# Altium schematic sheet Heaters.SchDoc: Heaters
size Letter; SheetNumber: 8; SheetTotal: 12
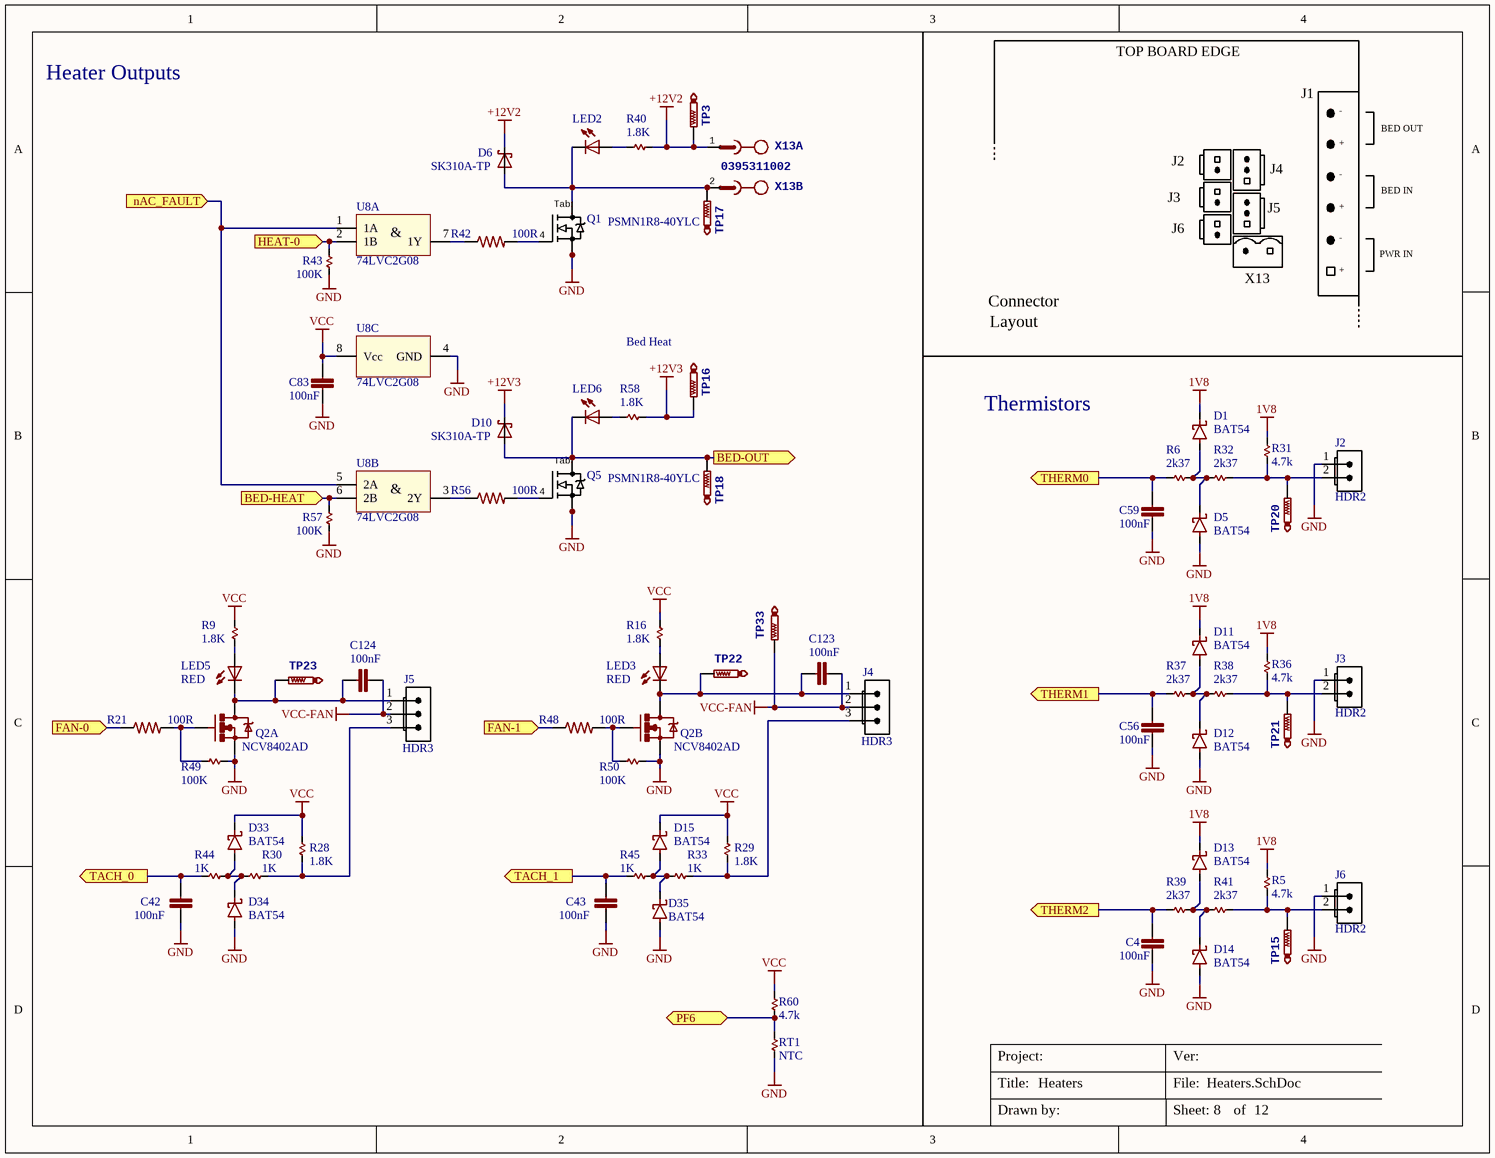
[diagram p0: Heaters.SchDoc]

## Parts
C4  100nF  [C0402]
C42  100nF  [C0402]
C43  100nF  [C0402]
C56  100nF  [C0402]
C59  100nF  [C0402]
C83  100nF  [C0402]
C123  100nF  [C0402]
C124  100nF  [C0402]
D1  BAT54  [SOD523_IPC]
D5  BAT54  [SOD523_IPC]
D6  SK310A-TP  [SMA-SM]
D10  SK310A-TP  [SMA-SM]
D11  BAT54  [SOD523_IPC]
D12  BAT54  [SOD523_IPC]
D13  BAT54  [SOD523_IPC]
D14  BAT54  [SOD523_IPC]
D15  BAT54  [SOD523_IPC]
D33  BAT54  [SOD523_IPC]
D34  BAT54  [SOD523_IPC]
D35  BAT54  [SOD523_IPC]
J2  value HDR2  [70543-02]  (hidden comment: CONN 2PIN VERT 0.1" SHRD LOCKING)
J3  value HDR2  [70543-02]  (hidden comment: CONN 2PIN VERT 0.1" SHRD LOCKING)
J4  value HDR3  [70543-03]  (hidden comment: Molex 70543-03)
J5  value HDR3  [70543-03]  (hidden comment: Molex 70543-03)
J6  value HDR2  [70543-02]  (hidden comment: CONN 2PIN VERT 0.1" SHRD LOCKING)
LED2  RED  [LED2012120]  (value not drawn)
LED3  RED  [LED2012120]
LED5  RED  [LED2012120]
LED6  RED  [LED2012120]  (value not drawn)
Q1  PSMN1R8-40YLC  [SOT669]
Q2  NCV8402AD  [NCV8402AD-SOIC8]  (parts A,B of 2)
Q5  PSMN1R8-40YLC  [SOT669]
R5  4.7k  [R0402]
R6  2k37  [R0402]
R9  1.8K  [R0402]
R16  1.8K  [R0402]
R21  100R  [R0402]
R28  1.8K  [R0402]
R29  1.8K  [R0402]
R30  1K  [R0402]
R31  4.7k  [R0402]
R32  2k37  [R0402]
R33  1K  [R0402]
R36  4.7k  [R0402]
R37  2k37  [R0402]
R38  2k37  [R0402]
R39  2k37  [R0402]
R40  1.8K  [R0402]
R41  2k37  [R0402]
R42  100R  [R0402]
R43  100K  [R0402]
R44  1K  [R0402]
R45  1K  [R0402]
R48  100R  [R0402]
R49  100K  [R0402]
R50  100K  [R0402]
R56  100R  [R0402]
R57  100K  [R0402]
R58  1.8K  [R0402]
R60  4.7k  [R0402]
RT1  value NTC  [R0402]  (hidden comment: NTCG104LH104JT1)
TP3  TestPoint  [TP1-27]  (value not drawn)  (no BOM)
TP15  TestPoint  [TP1-27]  (value not drawn)  (no BOM)
TP16  TestPoint  [TP1-27]  (value not drawn)  (no BOM)
TP17  TestPoint  [TP1-27]  (value not drawn)  (no BOM)
TP18  TestPoint  [TP1-27]  (value not drawn)  (no BOM)
TP20  TestPoint  [TP1-27]  (value not drawn)  (no BOM)
TP21  TestPoint  [TP1-27]  (value not drawn)  (no BOM)
TP22  TestPoint  [TP1-27]  (value not drawn)  (no BOM)
TP23  TestPoint  [TP1-27]  (value not drawn)  (no BOM)
TP33  TestPoint  [TP1-27]  (value not drawn)  (no BOM)
U8  74LVC2G08  [VSSOP8]  (parts A,B,C of 3)
X13  0395311002  [MSTBV2]  (parts A,B of 2)

## Ports
BED-HEAT, BED-OUT, FAN-0, FAN-1, HEAT-0, nAC_FAULT, PF6, TACH_0, TACH_1, THERM0, THERM1, THERM2

## Nets
1V8: D1.K D11.K D13.K R5.2 R31.2 R36.2
+12V2: D6.C R40.1 TP3.TP X13.1
+12V3: D10.C R58.1 TP16.TP
GND: C4.2 C42.2 C43.2 C56.2 C59.2 C83.2 D5.A D12.A D14.A D34.A D35.A J2.1(S) J3.1(S) J6.1(S) Q1.1(S) Q1.2(S) Q1.3(S) Q2.1(S) Q2.3(S) Q5.1(S) Q5.2(S) Q5.3(S) R43.1 R49.2 R50.2 R57.1 RT1.1 U8.4(GND)
VCC: C83.1 D15.K D33.K R9.1 R16.1 R28.2 R29.2 R60.2 U8.8(Vcc)
VCC-FAN: C123.2 C124.2 J4.2(S) J5.2(S) TP33.TP
BED-HEAT: R57.2 U8.6(2B) ; port BED-HEAT
BED-OUT: D10.A LED6.C Q5.MB(D) TP18.TP ; port BED-OUT
FAN-0: R21.1 ; port FAN-0
FAN-1: R48.1 ; port FAN-1
HEAT-0: R43.2 U8.2(1B) ; port HEAT-0
nAC_FAULT: U8.1(1A) U8.5(2A) ; port nAC_FAULT
PF6: R60.1 RT1.2 ; port PF6
TACH_0: C42.1 R44.1 ; port TACH_0
TACH_1: C43.1 R45.1 ; port TACH_1
THERM0: C59.1 R6.2 ; port THERM0
THERM1: C56.1 R37.2 ; port THERM1
THERM2: C4.1 R39.2 ; port THERM2
NetC123_1: C123.1 J4.1(S) LED3.C Q2.5(D) TP22.TP
NetC124_1: C124.1 J5.1(S) LED5.C Q2.7(D) TP23.TP
NetD1_A: D1.A D5.K R6.1 R32.2
NetD6_A: D6.A LED2.C Q1.MB(D) TP17.TP X13.2
NetD11_A: D11.A D12.K R37.1 R38.2
NetD13_A: D13.A D14.K R39.1 R41.2
NetD15_A: D15.A D35.K R33.1 R45.2
NetD33_A: D33.A D34.K R30.1 R44.2
NetJ2_2: J2.2(S) R31.1 R32.1 TP20.TP
NetJ3_2: J3.2(S) R36.1 R38.1 TP21.TP
NetJ4_3: J4.3(S) R29.1 R33.2
NetJ5_3: J5.3(S) R28.1 R30.2
NetJ6_2: J6.2(S) R5.1 R41.1 TP15.TP
NetLED2_A: LED2.A R40.2
NetLED3_A: LED3.A R16.2
NetLED5_A: LED5.A R9.2
NetLED6_A: LED6.A R58.2
NetQ1_4: Q1.4(G) R42.2
NetQ2_2: Q2.2(G) R21.2 R49.1
NetQ2_4: Q2.4(G) R48.2 R50.1
NetQ5_4: Q5.4(G) R56.2
NetR42_1: R42.1 U8.7(1Y)
NetR56_1: R56.1 U8.3(2Y)

Not connected (* = marked no-connect by the designer): U8 23(NC)

## Notes on the sheet
- Heater Outputs
- TOP BOARD EDGE
- J1
- J2
- +
- -
- BED OUT
- J3
- J6
- J5
- J4
- BED IN
- X13
- PWR IN
- Bed Heat
- Connector
- Layout
- Thermistors
- Title:
- Project:
- File:
- Ver:
- Drawn by:
- Sheet:
- of
- (in symbol 74LVC2G08, part A) &
- (in symbol 74LVC2G08, part B) &
- (in symbol PSMN1R8-40YLC) Tab

## Library data of the parts
C4 C42 C43 C56 C59 C83 C123 C124 = GRM155R71C104KA88D: CAP CER 0402 100nF 16V 10% X7R; Manufacturer: Murata; Part Description: 0.10µF ±10% 16V Ceramic Capacitor X7R 0402 (1005 Metric); EE_SPEC: 100nF 16V X7R 0402; Tolerance: +/- 10%; VALUE: 100nF; MANUFACTURER #: GRM155R71C104KA88D; DISTRIBUTOR #: 490-3261-2-ND; DISTRIBUTOR: Digi-Key; PART: 100nF
D1 D5 D11-D15 D33-D35 = BAT54WT-7: Diode Schottky 30V 100mA Surface Mount SOD-523; Manufacturer: Diodes Incorporated; EE_SPEC: 30V 0.1A; Tolerance: NA; Value: BAT54; MANUFACTURER #: BAT54WT-7; DISTRIBUTOR #: BAT54WT-7DI-ND; DISTRIBUTOR: Digi-Key; PART: BAT54; Part Description: Diode Schottky 30V 100mA Surface Mount SOD-523
D6 D10 = SK310A: DIODE Schottky 3A SMA; Manufacturer: MCC; MANUFACTURER #: SK310A-LTP; Part Description: Diode Schottky 100V 3A Surface Mount DO-214AC (SMA); EE_SPEC: 3A 100V; Tolerance: NA; VALUE: SK310A; DISTRIBUTOR #: SK310A-LTPMSTR-ND; DISTRIBUTOR: Digi-Key; PART: SK310A
J2 J3 J6 = CONN 2PIN VERT 0.1" SHRD LOCKING: Connector 2pos; MANUFACTURER: Molex; MANUFACTURER #: 0705430001; PART: 10 Pin Conn; PART DESCRIPTION: 2 Positions Header, Shrouded Connector 0.100" (2.54mm) Through Hole Gold; TOLERANCE: -NA-; DISTRIBUTOR #: WM4800-ND; DISTRIBUTOR: Digi-Key; EE_SPEC: -NA-
J4 J5 = CONN 3POS VERT 0.1" SHRD LOCKING: 3 Positions Header, Shrouded Connector 0.100" (2.54mm) Through Hole Gold; MANUFACTURER #: 0705430002; PART: 3 Pin Conn VERT; TOLERANCE: -NA-; MANUFACTURER: Molex; DISTRIBUTOR #: WM4801-ND; DISTRIBUTOR: Digi-Key; PART DESCRIPTION: 3 Positions Header, Shrouded Connector 0.100" (2.54mm) Through Hole Gold; EE_SPEC: -NA-
LED2 LED3 LED5 LED6 = 5988110107F: LED 0805 Red; Manufacturer: Dialight; Part Description: Red 635nm LED Indication - Discrete 2.2V 0805 (2012 Metric); EE_SPEC: 2.2V 0.02A; Tolerance: NA; VALUE: RED; DISTRIBUTOR #: 350-2038-2-ND; DISTRIBUTOR: Digi-Key; MANUFACTURER #: 5988110107F; PART: RED
Q1 Q5 = PSMN1R8-40YLC: MOSFET N-CH 40V 100A LFPAK; MANUFACTURER: Nexperia; MANUFACTURER #: PSMN1R8-40YLC,115; PART DESCRIPTION: N-Channel 40V 100A (Tc) 272W (Tc) Surface Mount LFPAK56, Power-SO8; EE_SPEC: 40V 100A 1.8mOhm; TOLERANCE: -NA-; VALUE: N-FET; DISTRIBUTOR #: 1727-1052-2-ND; DISTRIBUTOR: Digikey
Q2 = NCV8402AD: IC DVR LOW SIDE 8-SOIC; MANUFACTURER #: NCV8402ADDR2G; Manufacturer: On Semi; EE_SPEC: 42Vmaz 2A 0.165-Ohm; Tolerance: NA; DISTRIBUTOR #: NCV8402ADDR2GOSTR-ND; DISTRIBUTOR: Digi-Key; PART: NCV8402; Part Description: IC DVR LOW SIDE 8-SOIC; VALUE: NCV8402
R5 R31 R36 R60 = RC0402FR-074K7L: RES SMD 4.7K OHM 1% 1/16W 0402; Manufacturer: Yageo; Part Description: 4.7k Ohm ±1% 0.063W, 1/16W Chip Resistor 0402 (1005 Metric) Moisture Resistant Thick Film; EE_SPEC: 4.7k 1% 0402; Tolerance: +/- 1%; VALUE: 4.7k; MANUFACTURER #: RC0402FR-074K7L; DISTRIBUTOR #: 311-4.7KLRTR-ND; DISTRIBUTOR: Digi-Key; PART: 4.7k
R6 R32 R37-R39 R41 = RC0402FR-072K37L: RES SMD 2.37K OHM 1% 1/16W 0402; Manufacturer: Yageo; Part Description: 2.37k Ohm ±1% 0.063W, 1/16W Chip Resistor 0402 (1005 Metric) Moisture Resistant Thick Film; EE_SPEC: 2.37k 1% 0402; Tolerance: +/- 1%; VALUE: 2k37; MANUFACTURER #: RC0402FR-072K37L; DISTRIBUTOR #: 311-2.37KLRTR-ND; DISTRIBUTOR: Digi-Key; PART: 2.37k
R9 R16 R28 R29 R40 R58 = RC0402FR-071K8L: RES SMD 1.8K OHM 1% 1/16W 0402; Manufacturer: Yageo; Part Description: 1.8k Ohm ±1% 0.063W, 1/16W Chip Resistor 0402 (1005 Metric) Moisture Resistant Thick Film; EE_SPEC: 1.8k 1% 0402; Tolerance: +/- 1%; VALUE: 1.8K; MANUFACTURER #: RC0402FR-071K8L; DISTRIBUTOR #: 311-1.80KLRTR-ND; DISTRIBUTOR: Digi-Key; PART: 1.8k
R21 R42 R48 R56 = RES 100R 0402 1%: RES SMD 100 OHM 1% 1/16W 0402; MANUFACTURER: Yageo; MANUFACTURER #: RC0402FR-07100RL; PART: 100R 1% 0402; PART DESCRIPTION: 100 Ohm ±1% 0.063W, 1/16W Chip Resistor 0402 (1005 Metric) Moisture Resistant Thick Film; VALUE: 100R; DISTRIBUTOR #: 311-100LRTR-ND; DISTRIBUTOR: Digi-Key; TOLERANCE: 1%; EE_SPEC: 100R 1% 0402
R30 R33 R44 R45 = RC0402FR-071KL: RES SMD 1K OHM 1% 1/16W 0402; Manufacturer: Yageo; Part Description: 1k Ohm ±1% 0.063W, 1/16W Chip Resistor 0402 (1005 Metric) Moisture Resistant Thick Film; EE_SPEC: 1k 1% 0402; Tolerance: +/- 1%; VALUE: 1K; MANUFACTURER #: RC0402FR-071KL; DISTRIBUTOR #: 311-1.00KLRTR-ND; DISTRIBUTOR: Digi-Key; PART: 1k
R43 R49 R50 R57 = RC0402FR-07100KL: RES 100K OHM 1% 1/16W 0402; Manufacturer: Yageo; Part Description: 100k Ohm ±1% 0.063W, 1/16W Chip Resistor 0402 (1005 Metric) Moisture Resistant Thick Film; EE_SPEC: 100K 1% 0402; Tolerance: +/- 1%; VALUE: 100K; DISTRIBUTOR #: 311-100KLRTR-ND; DISTRIBUTOR: Digi-Key; MANUFACTURER #: RC0402FR-07100KL; PART: 100K
RT1 = THERM_NTC: NTC THERMISTOR 100K OHM 5% 0402; MANUFACTURER: TDK; PART DESCRIPTION: NTC Thermistor 100k 0402 (1005 Metric); EE_SPEC: 100mW; MANUFACTURER #: NTCG104LH104JT1; DISTRIBUTOR #: 445-174317-2-ND; DISTRIBUTOR: Digikey; PART: NTC; TOLERANCE: 5%
TP3 TP15-TP18 TP20-TP23 TP33 = TestPoint: Test Point
U8 = 74LVC2G08: IC GATE AND 2CH 2-INP 8-VSSOP; MANUFACTURER #: 74LVC2G08DC,125; MANUFACTURER: Nexperia; PART DESCRIPTION: AND Gate IC 2 Channel 8-VSSOP, US8; TOLERANCE: -NA-; EE_SPEC: 1.65-5.5V, 32mA, LVTTL; VALUE: -NA-; DISTRIBUTOR #: 1727-3560-2-ND; DISTRIBUTOR: Digikey; PART: 74LVC2G08
X13 = 0395311002: Conn - 5.08mm Pitch Fixed; Manufacturer: Molex; PART: 2POS; Part Description: 2 Position Terminal Block Header, Male Pins, Shrouded (4 Side) 0.200" (5.08mm) Vertical Through Hole; EE_SPEC: 300V 15A 0.2"; Tolerance: NA; Value: 0395311002; DISTRIBUTOR #: WM7837-ND; DISTRIBUTOR: Digi-Key; MANUFACTURER #: 0395311002